# EAGLE design DisplayCarrier (EAGLE 9.4.2)
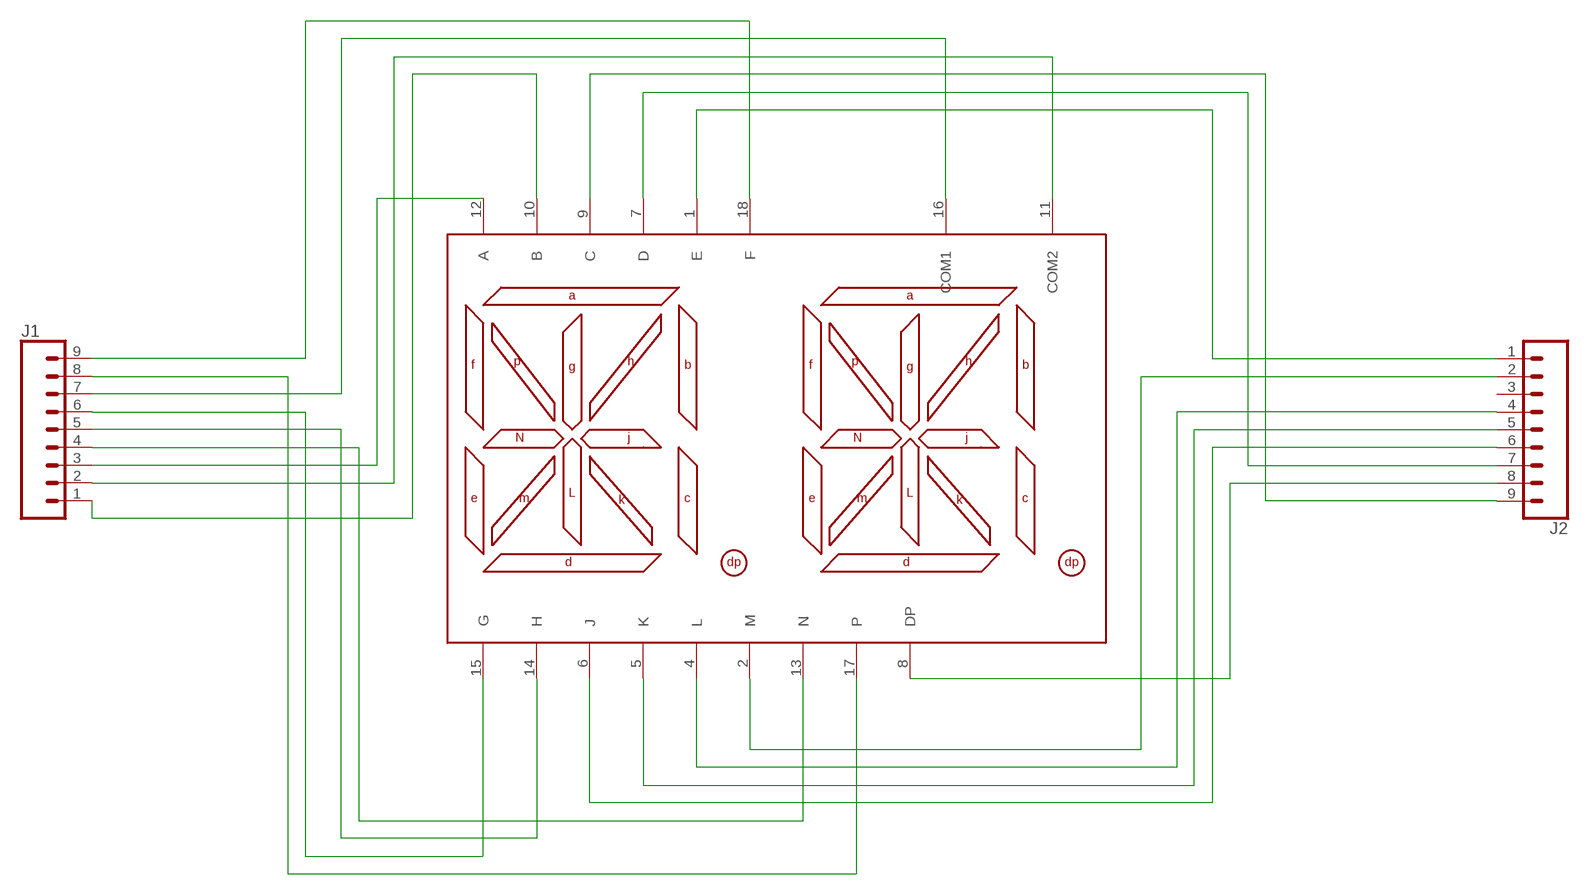
[diagram p0: schematic, sheet 1]

## Parts
J1  CONN_09  [1X09]
J2  CONN_09  [1X09]
U$1  HDSP-A27C  [DIP-18]

## Nets
N$1: J2.1 U$1.1(E)
N$2: J1.1 U$1.10(B)
N$3: J1.2 U$1.11(COM2)
N$4: J1.3 U$1.12(A)
N$5: J1.4 U$1.13(N)
N$6: J1.5 U$1.14(H)
N$7: J1.6 U$1.15(G)
N$8: J1.7 U$1.16(COM1)
N$9: J1.8 U$1.17(P)
N$10: J2.2 U$1.2(M)
N$11: J2.4 U$1.4(L)
N$12: J2.5 U$1.5(K)
N$13: J2.6 U$1.6(J)
N$14: J2.7 U$1.7(D)
N$15: J2.8 U$1.8(DP)
N$16: J1.9 U$1.18(F)
N$25: J2.9 U$1.9(C)
Unconnected: J2.3

## Library data of the parts
J1 J2 = SparkFun-Connectors:CONN_09: Multi connection point. Often used as Generic Header-pin footprint for 0.1 inch spaced/style header connections On any of the 0.1 inch spaced packages, you can populate with these: Break Away Headers - Straight <https://www.sparkfun.com/products/116> (PRT-00116) Break Away Male Headers - Right Angle <https://www.sparkfun.com/products/553> (PRT-00553) Female Headers <https://www.sparkfun.com/products/115> (PRT-00115) Break Away Headers - Machine Pin <https://www.sparkfun.com/products/117> (PRT-00117) Break Away Female Headers - Swiss Machine Pin <https://www.sparkfun.com/products/743> (PRT-00743) For SCREWTERMINALS and SPRING TERMINALS visit here: Screw Terimnals on SparkFun.com <https://www.sparkfun.com/search/results?term=Screw+Terminals> (5mm/3.5mm/2.54mm spacing) This device is also useful as a general connection point to wire up your design to another part of your project. Our various solder wires solder well into these plated through hole pads. Hook-Up Wire - Assortment (Stranded, 22 AWG) <https://www.sparkfun.com/products/11375> (PRT-11375) Hook-Up Wire - Assortment (Solid Core, 22 AWG) <https://www.sparkfun.com/products/11367> (PRT-11367) View the entire wire category on our website here <https://www.sparkfun.com/categories/141> Special notes: Molex polarized connector foot print use with SKU : PRT-08231 with associated crimp pins and housings. 1MM SMD Version SKU: PRT-10208 NOTES ON THE VARIANTS LOCK and LOCK_LONGPADS... This footprint was designed to help hold the alignment of a through-hole component (i.e. 6-pin header) while soldering it into place. You may notice that each hole has been shifted either up or down by 0.005 of an inch from it's more standard position (which is a perfectly straight line). This slight alteration caused the pins (the squares in the middle) to touch the edges of the holes. Because they are alternating, it causes a "brace" to hold the component in place. 0.005 has proven to be the perfect amount of "off-center" position when using our standard breakaway headers. Although looks a little odd when you look at the bare footprint, once you have a header in there, the alteration is very hard to notice. Also,if you push a header all the way into place, it is covered up entirely on the bottom side.
U$1 = Segment displays:HDSP-A27C

## Board
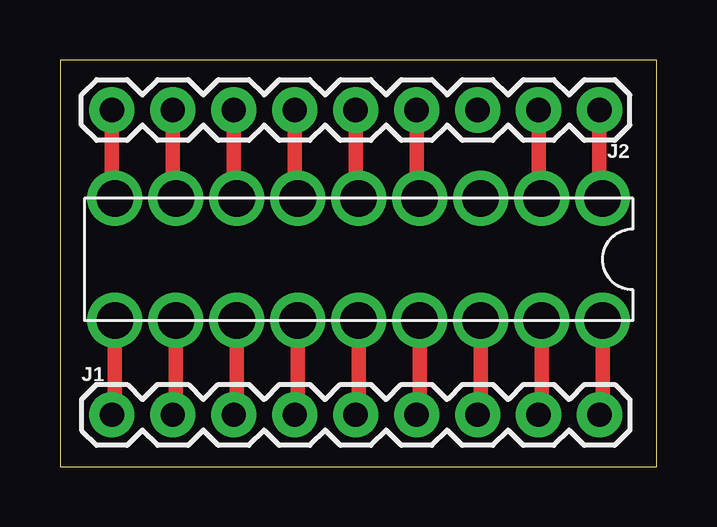
[diagram p1: board, top side]

Size 24.87 x 16.94 mm. Coordinates in mm from the lower left corner, seen from the top.
Outline: 0,0 24.87,0 24.87,16.94 0,16.94 0,0
Copper layers (1*16): Top 0.035mm / dielectric 1.5mm / Bottom 0.035mm
Design rules "default": minimum track width 6mil, minimum drill 0.35mm, track to track 6mil, track to pad 6mil, pad to pad 6mil, via to via 6mil, smd to smd 6mil, copper to edge 40mil, drill to drill 6mil, minimum pad ring 10mil, minimum via ring 8mil, stop-mask expansion 4mil, vias tented up to drill 0mil, thermal gap 10mil

### Footprints (pad centres in the part's own frame; a part is rotated, then mirrored left to right if it is on the bottom)
1X09 = drill 1.016 pad 1.88: 1 0,0; 2 2.54,0; 3 5.08,0; 4 7.62,0; 5 10.16,0; 6 12.7,0; 7 15.24,0; 8 17.78,0; 9 20.32,0
DIP-18 = drill 1.524: 1 7.62,2.54; 2 5.08,2.54; 3 2.54,2.54; 4 0,2.54; 5 -2.54,2.54; 6 -5.08,2.54; 7 -7.62,2.54; 8 -10.16,2.54; 9 -12.7,2.54; 10 -12.7,-2.54; 11 -10.16,-2.54; 12 -7.62,-2.54; 13 -5.08,-2.54; 14 -2.54,-2.54; 15 0,-2.54; 16 2.54,-2.54; 17 5.08,-2.54; 18 7.62,-2.54

### Placement (x,y rotation side)
J1  2.16,2.16 0 top
J2  22.48,14.86 180 top
U$1  14.99,8.64 0 top

### Tracks (layer width: path | path; a pad name or v marks a point on that pad's centre or on a via)
N$1
  Top 0.61: U$1.1 22.48,11.3 J2.1
N$2
  Top 0.61: U$1.10 2.29,2.29 J1.1
N$3
  Top 0.61: U$1.11 4.83,2.29 J1.2
N$4
  Top 0.61: U$1.12 7.37,2.29 J1.3
N$5
  Top 0.61: U$1.13 9.91,2.29 J1.4
N$6
  Top 0.61: U$1.14 12.45,2.29 J1.5
N$7
  Top 0.61: U$1.15 14.99,2.29 J1.6
N$8
  Top 0.61: U$1.16 17.53,2.29 J1.7
N$9
  Top 0.61: U$1.17 20.07,2.29 J1.8
N$10
  Top 0.61: U$1.2 19.94,11.3 J2.2
N$11
  Top 0.61: U$1.4 14.86,11.3 J2.4
N$12
  Top 0.61: U$1.5 12.32,11.3 J2.5
N$13
  Top 0.61: U$1.6 9.78,11.3 J2.6
N$14
  Top 0.61: U$1.7 7.24,11.3 J2.7
N$15
  Top 0.61: U$1.8 4.7,11.3 J2.8
N$16
  Top 0.61: U$1.18 22.61,2.29 J1.9
N$25
  Top 0.61: U$1.9 2.16,11.3 J2.9